# Altium schematic sheet DeHumidity.SchDoc
size A4
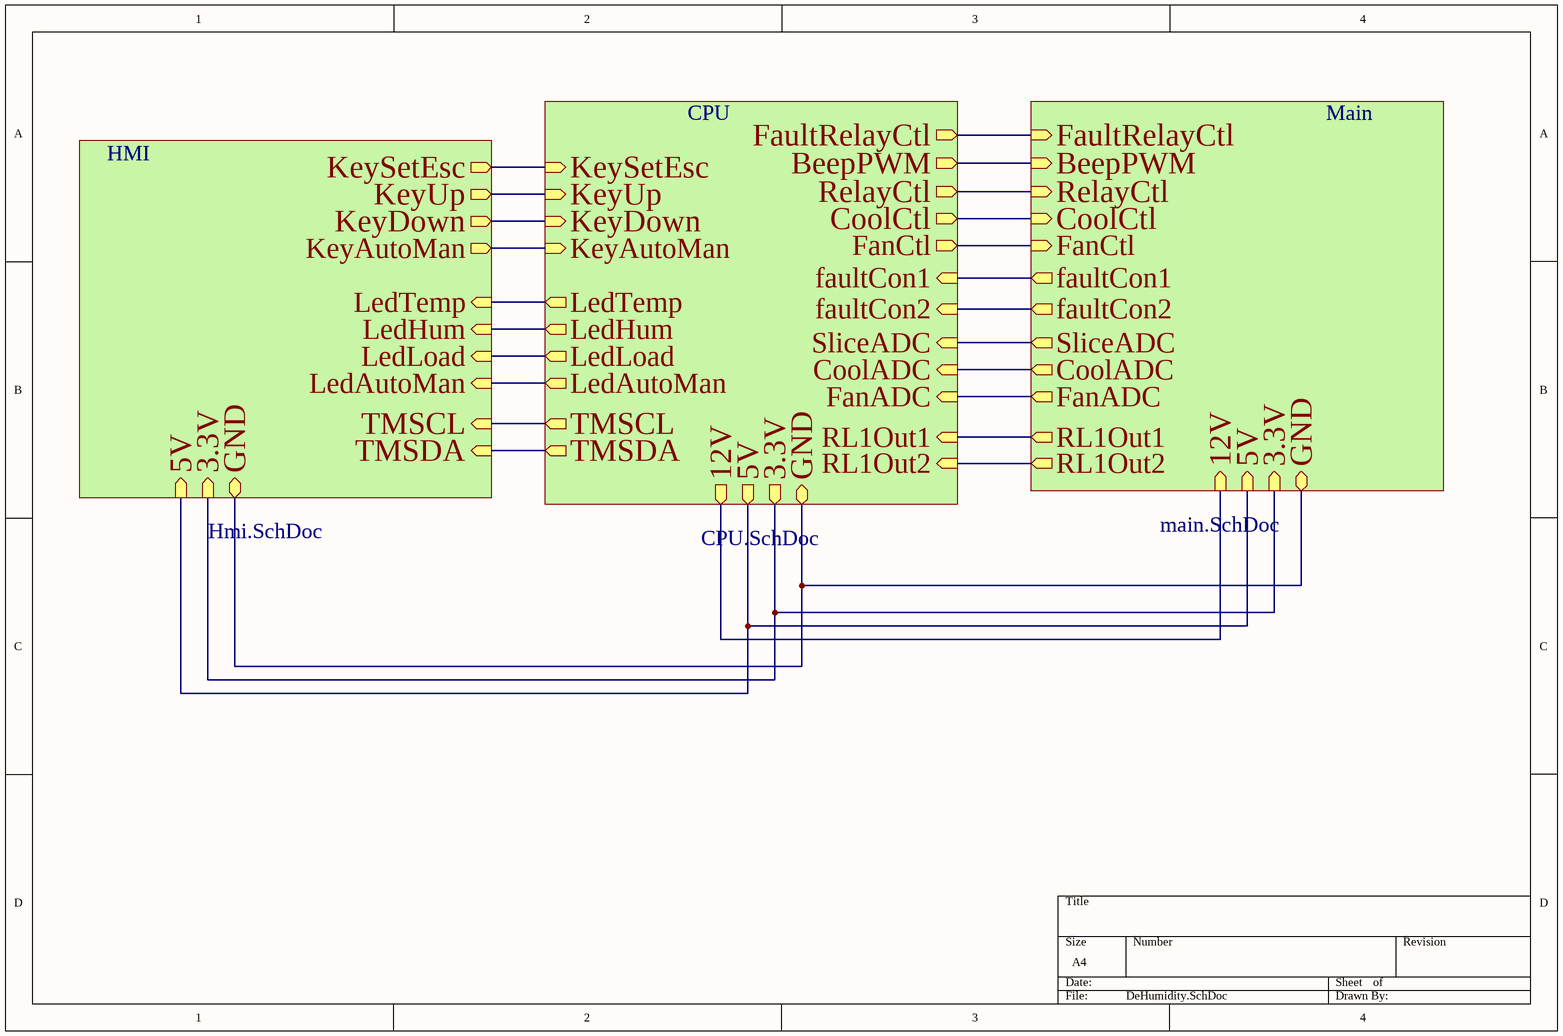
[diagram p0: DeHumidity.SchDoc]

## Sub-sheets
CPU = CPU.SchDoc: LedTemp (out), 3.3V (out), GND (bidir), 5V (out), LedHum (out), LedLoad (out), LedAutoMan (out), KeyAutoMan (in), KeyUp (in), KeyDown (in), KeySetEsc (in), RL1Out1 (in), RelayCtl (out), CoolCtl (out), BeepPWM (out), FanCtl (out), SliceADC (in), CoolADC (in), FanADC (in), 12V (out), TMSCL (out), TMSDA (out), RL1Out2 (in), faultCon1 (in), faultCon2 (in), FaultRelayCtl (out)
HMI = Hmi.SchDoc: LedTemp (in), KeyAutoMan (out), KeyUp (out), KeyDown (out), KeySetEsc (out), LedHum (in), LedLoad (in), LedAutoMan (in), TMSCL (in), TMSDA (in), 3.3V (in), GND (bidir), 5V (in)
Main = main.SchDoc: RL1Out1 (out), RelayCtl (in), CoolCtl (in), BeepPWM (in), SliceADC (out), CoolADC (out), FanADC (out), FanCtl (in), 3.3V (in), GND (bidir), 5V (in), 12V (in), RL1Out2 (out), faultCon1 (out), faultCon2 (out), FaultRelayCtl (in)

## Nets
(unnamed): sheet HMI/LedTemp, sheet CPU/LedTemp
(unnamed): sheet HMI/KeyAutoMan, sheet CPU/KeyAutoMan
(unnamed): sheet HMI/KeyUp, sheet CPU/KeyUp
(unnamed): sheet HMI/KeyDown, sheet CPU/KeyDown
(unnamed): sheet HMI/KeySetEsc, sheet CPU/KeySetEsc
(unnamed): sheet HMI/LedHum, sheet CPU/LedHum
(unnamed): sheet HMI/LedLoad, sheet CPU/LedLoad
(unnamed): sheet HMI/LedAutoMan, sheet CPU/LedAutoMan
(unnamed): sheet HMI/TMSCL, sheet CPU/TMSCL
(unnamed): sheet HMI/TMSDA, sheet CPU/TMSDA
(unnamed): sheet HMI/3.3V, sheet Main/3.3V, sheet CPU/3.3V
(unnamed): sheet HMI/GND, sheet Main/GND, sheet CPU/GND
(unnamed): sheet HMI/5V, sheet Main/5V, sheet CPU/5V
(unnamed): sheet Main/RL1Out1, sheet CPU/RL1Out1
(unnamed): sheet Main/RelayCtl, sheet CPU/RelayCtl
(unnamed): sheet Main/CoolCtl, sheet CPU/CoolCtl
(unnamed): sheet Main/BeepPWM, sheet CPU/BeepPWM
(unnamed): sheet Main/SliceADC, sheet CPU/SliceADC
(unnamed): sheet Main/CoolADC, sheet CPU/CoolADC
(unnamed): sheet Main/FanADC, sheet CPU/FanADC
(unnamed): sheet Main/FanCtl, sheet CPU/FanCtl
(unnamed): sheet Main/12V, sheet CPU/12V
(unnamed): sheet Main/RL1Out2, sheet CPU/RL1Out2
(unnamed): sheet Main/faultCon1, sheet CPU/faultCon1
(unnamed): sheet Main/faultCon2, sheet CPU/faultCon2
(unnamed): sheet Main/FaultRelayCtl, sheet CPU/FaultRelayCtl